# Altium project rpi_childboard.PrjPcb
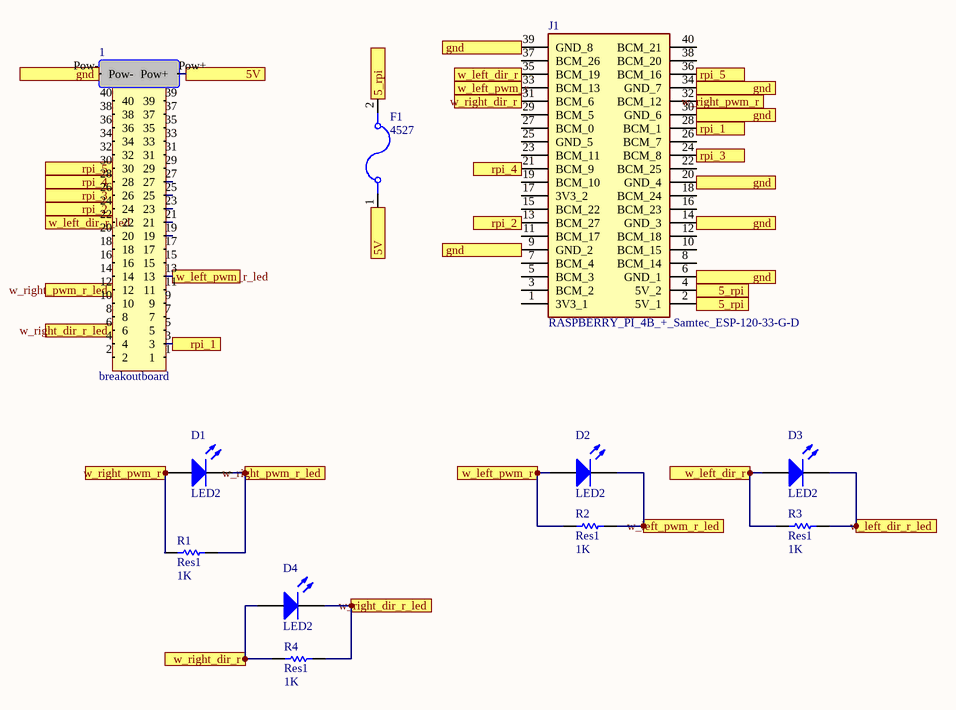
[diagram p0: rpi_childboard_schematic.SchDoc]
1 sheet, 11 parts. Net scope: flat (ports and power ports of the same name join across sheets).
Board file: rpi_childboard_pcb.PcbDoc

## Sheet rpi_childboard_schematic.SchDoc
size A; SheetNumber: 1; SheetTotal: 1

### Parts
1  breakoutboard  [breakoutboard connections]
D1  LED2  [3.2X1.6X1.1]
D2  LED2  [3.2X1.6X1.1]
D3  LED2  [3.2X1.6X1.1]
D4  LED2  [3.2X1.6X1.1]
F1  4527  [FUSE_4527]
J1  RASPBERRY_PI_4B_+_Samtec_ESP-120-33-G-D  [RASPBERRYPI4B4GB]
R1  Res1  value 1K  [AXIAL-0.3]
R2  Res1  value 1K  [AXIAL-0.3]
R3  Res1  value 1K  [AXIAL-0.3]
R4  Res1  value 1K  [AXIAL-0.3]

### Ports
5_rpi, 5V, gnd, rpi_1, rpi_2, rpi_3, rpi_4, rpi_5, w_left_dir_r, w_left_dir_r_led, w_left_pwm_r, w_left_pwm_r_led, w_right_dir_r, w_right_dir_r_led, w_right_pwm_r, w_right_pwm_r_led

### Nets
Net1_3: 1.3 J1.28(BCM_1) ; port rpi_1
Net1_6: 1.6 D4.2(K) R4.2 ; port w_right_dir_r_led
Net1_12: 1.12 D1.2(K) R1.2 ; port w_right_pwm_r_led
Net1_13: 1.13 D2.2(K) R2.2 ; port w_left_pwm_r_led
Net1_22: 1.22 D3.2(K) R3.2 ; port w_left_dir_r_led
Net1_24: 1.24 J1.13(BCM_27) ; port rpi_2
Net1_26: 1.26 J1.24(BCM_8) ; port rpi_3
Net1_28: 1.28 J1.21(BCM_9) ; port rpi_4
Net1_30: 1.30 J1.36(BCM_16) ; port rpi_5
Net1_Pow+: 1.Pow+ F1.1 ; port 5V
Net1_Pow-: 1.Pow- J1.6(GND_1) J1.9(GND_2) J1.14(GND_3) J1.20(GND_4) J1.30(GND_6) J1.34(GND_7) J1.39(GND_8) ; port gnd
NetD1_1: D1.1(A) J1.32(BCM_12) R1.1 ; port w_right_pwm_r
NetD2_1: D2.1(A) J1.33(BCM_13) R2.1 ; port w_left_pwm_r
NetD3_1: D3.1(A) J1.35(BCM_19) R3.1 ; port w_left_dir_r
NetD4_1: D4.1(A) J1.31(BCM_6) R4.1 ; port w_right_dir_r
NetF1_2: F1.2 J1.2(5V_1) J1.4(5V_2) ; port 5_rpi

Not connected (* = marked no-connect by the designer): 1 1 2 4 5 7 8 9 10 11 14 15 16 17 18 19 20 21 23 25 27 29 31 32 33 34 35 36 37 38 39 40; J1 1(3V3_1) 3(BCM_2) 5(BCM_3) 7(BCM_4) 8(BCM_14) 10(BCM_15) 11(BCM_17) 12(BCM_18) 15(BCM_22) 16(BCM_23) 17(3V3_2) 18(BCM_24) 19(BCM_10) 22(BCM_25) 23(BCM_11) 25(GND_5) 26(BCM_7) 27(BCM_0) 29(BCM_5) 37(BCM_26) 38(BCM_20) 40(BCM_21)

### Library data of the parts
D1-D4 = LED2: Typical RED, GREEN, YELLOW, AMBER GaAs LED; Published: 8-Jun-2000; LatestRevisionDate: 17-Jul-2002; LatestRevisionNote: Re-released for DXP Platform.; PackageVersion: Feb-2002; PackageReference: 3.2X1.6X1.1; Publisher: Altium Limited; PackageDescription: SM LED; 2 Flat Leads
F1 = 4527: Fuseholder; 5 A; 250 V; Nylon; Base only; Brass, Tin Plate (Contact); Value: *; MP: 4527; Package: None; Availability: Unavailable; Price: None
J1 = RASPBERRY_PI_4B_+_Samtec_ESP-120-33-G-D: Connector; Manufacturer_Name: RASPBERRY-PI; Manufacturer_Part_Number: RASPBERRY PI 4B + Samtec ESP-120-33-G-D; Datasheet Link: https://www.raspberrypi.org/documentation/hardware/raspberrypi/mechanical/rpi_MECH_4b_4p0.pdf; Height: 24.3mm
R1-R4 = Res1: Resistor; Published: 8-Jun-2000; LatestRevisionDate: 17-Jul-2002; LatestRevisionNote: Re-released for DXP Platform.; PackageReference: AXIAL-0.3; Publisher: Altium Limited; PackageDescription: Axial Device, Thru-Hole; 2 Leads; 0.3 in Pin Spacing